# Altium schematic sheet Kill_Board_Top.SchDoc
size A
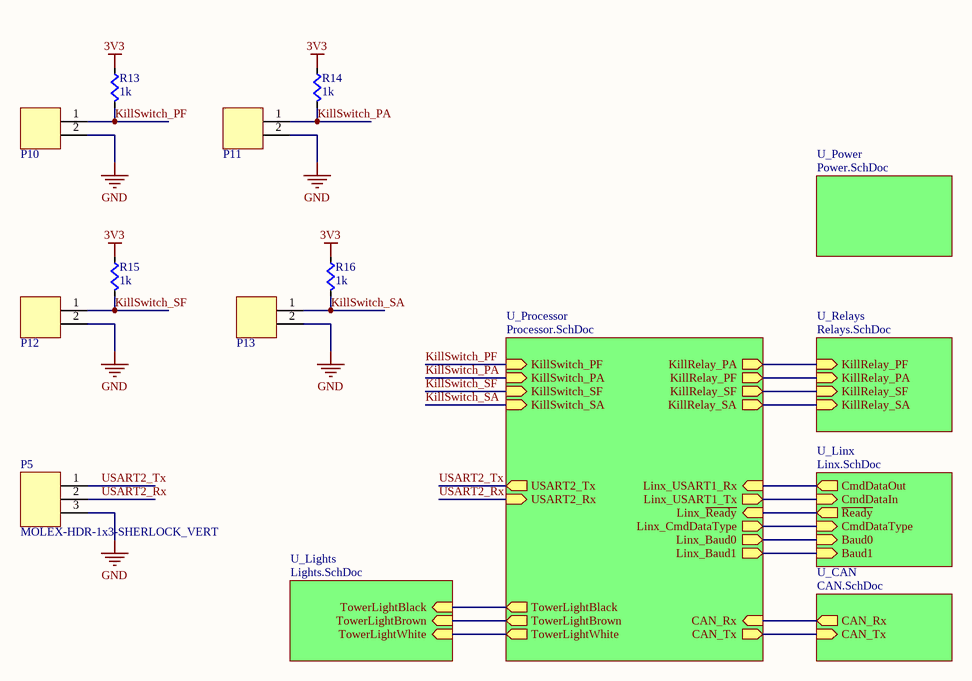
[diagram p0: Kill_Board_Top.SchDoc]

## Parts
P5  MOLEX-HDR-1x3-SHERLOCK_VERT  [MOLEX-HDR-1X3-SHERLOCK-VERT]
P10  2-pin Horz Sherlock  [MOLEX-HDR-1X2-SHERLOCK-HORZ]  (value not drawn)
P11  2-pin Horz Sherlock  [MOLEX-HDR-1X2-SHERLOCK-HORZ]  (value not drawn)
P12  2-pin Horz Sherlock  [MOLEX-HDR-1X2-SHERLOCK-HORZ]  (value not drawn)
P13  2-pin Horz Sherlock  [MOLEX-HDR-1X2-SHERLOCK-HORZ]  (value not drawn)
R13  value 1k  [RES0603]  (hidden comment: Res)
R14  value 1k  [RES0603]  (hidden comment: Res)
R15  value 1k  [RES0603]  (hidden comment: Res)
R16  value 1k  [RES0603]  (hidden comment: Res)

## Sub-sheets
U_CAN = CAN.SchDoc: CAN_Rx (out), CAN_Tx (in)
U_Lights = Lights.SchDoc: TowerLightWhite (in), TowerLightBrown (in), TowerLightBlack (in)
U_Linx = Linx.SchDoc: ~{Ready} (out), CmdDataType (in), CmdDataOut (out), CmdDataIn (in), Baud0 (in), Baud1 (in)
U_Power = Power.SchDoc: no entries
U_Processor = Processor.SchDoc: KillSwitch_PF (in), TowerLightWhite (out), Linx_Baud1 (out), KillSwitch_PA (in), KillSwitch_SF (in), KillSwitch_SA (in), Linx_Baud0 (out), TowerLightBrown (out), TowerLightBlack (out), KillRelay_PF (out), KillRelay_PA (out), KillRelay_SF (out), KillRelay_SA (out), USART2_Rx (in), USART2_Tx (out), Linx_USART1_Rx (in), Linx_USART1_Tx (out), CAN_Rx (in), CAN_Tx (out), Linx_CmdDataType (out), Linx_~{Ready} (in)
U_Relays = Relays.SchDoc: KillRelay_PF (in), KillRelay_PA (in), KillRelay_SF (in), KillRelay_SA (in)

## Nets
3V3: R13.2(B) R14.2(B) R15.2(B) R16.2(B)
GND: P5.3 P10.2 P11.2 P12.2 P13.2
KillSwitch_PA: P11.1 R14.1(A) ; sheet U_Processor/KillSwitch_PA
KillSwitch_PF: P10.1 R13.1(A) ; sheet U_Processor/KillSwitch_PF
KillSwitch_SA: P13.1 R16.1(A) ; sheet U_Processor/KillSwitch_SA
KillSwitch_SF: P12.1 R15.1(A) ; sheet U_Processor/KillSwitch_SF
USART2_Rx: P5.2 ; sheet U_Processor/USART2_Rx
USART2_Tx: P5.1 ; sheet U_Processor/USART2_Tx
(unnamed): sheet U_Processor/TowerLightWhite, sheet U_Lights/TowerLightWhite
(unnamed): sheet U_Processor/Linx_Baud1, sheet U_Linx/Baud1
(unnamed): sheet U_Processor/Linx_Baud0, sheet U_Linx/Baud0
(unnamed): sheet U_Processor/TowerLightBrown, sheet U_Lights/TowerLightBrown
(unnamed): sheet U_Processor/TowerLightBlack, sheet U_Lights/TowerLightBlack
(unnamed): sheet U_Processor/KillRelay_PF, sheet U_Relays/KillRelay_PA
(unnamed): sheet U_Processor/KillRelay_PA, sheet U_Relays/KillRelay_PF
(unnamed): sheet U_Processor/KillRelay_SF, sheet U_Relays/KillRelay_SF
(unnamed): sheet U_Processor/KillRelay_SA, sheet U_Relays/KillRelay_SA
(unnamed): sheet U_Processor/Linx_USART1_Rx, sheet U_Linx/CmdDataOut
(unnamed): sheet U_Processor/Linx_USART1_Tx, sheet U_Linx/CmdDataIn
(unnamed): sheet U_Processor/CAN_Rx, sheet U_CAN/CAN_Rx
(unnamed): sheet U_Processor/CAN_Tx, sheet U_CAN/CAN_Tx
(unnamed): sheet U_Processor/Linx_CmdDataType, sheet U_Linx/CmdDataType
(unnamed): sheet U_Processor/Linx_~{Ready}, sheet U_Linx/~{Ready}

## Library data of the parts
P5 = MOLEX-HDR-1x3-SHERLOCK_VERT: Header, Molex, 2mm Pitch Sherlock Header, Single Row, Vertical, 3 Circuits, Length 3.3mm, 0353620376; Supplier 1: Digi-Key; Supplier Part Number 1: WM18921-ND
P10-P13 = MOLEX-HDR-1x2-SHERLOCK_RA: Header, Molex, 2mm Pitch Sherlock Header, Single Row, Horizontal, 2 Circuits, Length 3.3mm,  0353630260; Manufacturer: Molex Inc; Manufacturer Part Number: 0353630260; Supplier Part Number 1: WM18931-ND; Supplier 1: Digi-Key
R13-R16 = Res: Supplier 1: Digi-Key; Supplier Part Number 1: RMCF0603JT10K0CT-ND